# Altium schematic sheet Logica_ADC.SchDoc: CSN Detector V5
size A4; CheckedBy: RCP; Author: RCP; DrawnBy: RCP; Address1: LIM-HGGM; Address3: RCP; DocumentNumber: 1; Revision: 1; SheetNumber: 2; SheetTotal: 2; PageSetup: Record=PageOptions|CenterHorizontal=True|CenterVertical=True|PrintScale=0.97|XCorrection=1.00|YCorrection=1.00|PrintKind=0|BorderSize=5000000|LeftOffset=0|BottomOffset=0|Orientation=2|PaperLength=1000|PaperWidth=1000|Scale=100|PaperSource=7|PrintQuality=-4|MediaType=1|DitherType=10|PaperKind=A4|PrintScaleMode=1
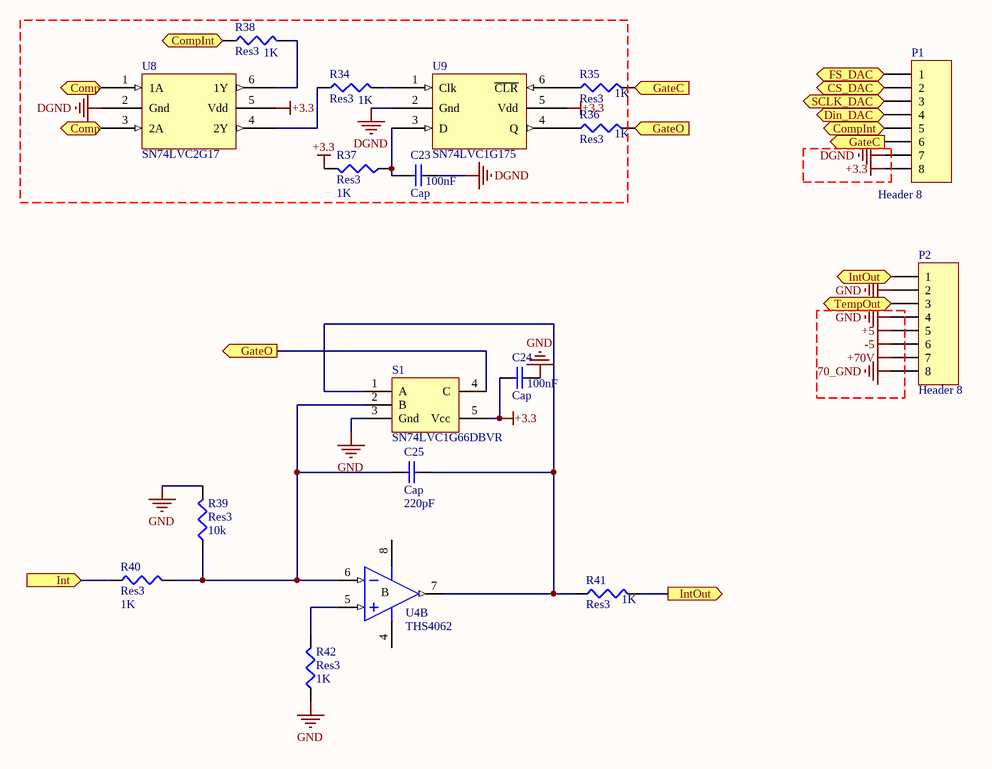
[diagram p0: Logica_ADC.SchDoc]

## Parts
C23  Cap  value 100nF  [J1-0603]
C24  Cap  value 100nF  [J1-0603]
C25  Cap  value 220pF  [J1-0603]
P1  Header 8  [HDR1X8]
P2  Header 8  [HDR1X8]
R34  Res3  value 1K  [J1-0603]
R35  Res3  value 1K  [J1-0603]
R36  Res3  value 1K  [J1-0603]
R37  Res3  value 1K  [J1-0603]
R38  Res3  value 1K  [J1-0603]
R39  Res3  value 10k  [J1-0603]
R40  Res3  value 1K  [J1-0603]
R41  Res3  value 1K  [J1-0603]
R42  Res3  value 1K  [J1-0603]
S1  SN74LVC1G66DBVR  [SOT23-5]
U4  THS4062  [SO-8_N]  (part B of 2)
U8  SN74LVC2G17  [SOT23-6_N]
U9  SN74LVC1G175  [SOT23-6_N]

## Ports
Comp (out), CompInt (out), CS_DAC (out), Din_DAC (out), FS_DAC (out), GateC (out), GateO (out), Int (in), IntOut (out), SCLK_DAC (out), TempOut (out)

## Nets
70_GND: P2.8
+3.3: C24.2 P1.8 R37.2 S1.5(Vcc) U8.5(Vdd) U9.5(Vdd)
+5: P2.5
+70V: P2.7
-5: P2.6
DGND: C23.1 P1.7 U8.2(Gnd) U9.2(Gnd)
GND: C24.1 P2.2 P2.4 R39.2 R42.1 S1.3(Gnd)
Comp: U8.1(1A) U8.3(2A) ; port Comp
CompInt: P1.5 R38.1 ; port CompInt
CS_DAC: P1.2 ; port CS_DAC
Din_DAC: P1.4 ; port Din_DAC
FS_DAC: P1.1 ; port FS_DAC
GateC: P1.6 R35.2 ; port GateC
GateO: R36.2 S1.4(C) ; port GateO
Int: R40.1 ; port Int
IntOut: P2.1 R41.2 ; port IntOut
SCLK_DAC: P1.3 ; port SCLK_DAC
TempOut: P2.3 ; port TempOut
NetC23_2: C23.2 R37.1 U9.3(D)
NetC25_1: C25.1 R39.1 R40.2 S1.2(B) U4.6(IN-)
NetC25_2: C25.2 R41.1 S1.1(A) U4.7(OUT)
NetR34_1: R34.1 U8.4(2Y)
NetR34_2: R34.2 U9.1(Clk)
NetR35_1: R35.1 U9.6(~{CLR})
NetR36_1: R36.1 U9.4(Q)
NetR38_2: R38.2 U8.6(1Y)
NetR42_2: R42.2 U4.5(IN+)

Not connected (* = marked no-connect by the designer): U4 4(V-) 8(V+)

## Notes on the sheet
- Title
- Size:
- Date:
- A4
- Number:
- Time:
- Revision:
- Sheet
- of
- File:
- (in symbol AD8002AR, part B) B

## Library data of the parts
C23-C25 = Cap: Capacitor; Published: 8-Jun-2000; LatestRevisionDate: 17-Jul-2002; LatestRevisionNote: Re-released for DXP Platform.; PackageReference: RAD-0.3; Publisher: Altium Limited; PackageDescription: Radial Cap, Thru-Hole; 2 Leads; 0.3 in Pin Spacing
P1 P2 = Header 8: Header, 8-Pin; LatestRevisionDate: 17-Jul-2002; LatestRevisionNote: Re-released for DXP Platform.; Publisher: Altium Limited
R34-R42 = Res3: Resistor; Published: 8-Jun-2000; LatestRevisionDate: 29-May-2009; LatestRevisionNote: IPC-7351 Footprint Added.; PackageReference: J1-0603; Publisher: Altium Limited; PackageDescription: Chip Resistor
U4 = AD8002AR: Dual 600MHz, 50mW Current Feedback Amplifier; Published: 8-Jun-2000; LatestRevisionDate: 13-Apr-2006; LatestRevisionNote: IPC-7351 Footprint Added.; DatasheetVersion: REV. C 1999; PackageVersion: revA; PackageReference: SO-8; Publisher: Altium Limited; PackageDescription: 8-Pin Small Outline Integrated Circuit 1.27 mm Pitch; Code_JEDEC: MS-012-AA; Code_IPC: SOIC127P600-8; ComponentLink1Description: Manufacturer Link; ComponentLink1URL: http://www.analog.com/en/prod/0,,759_786_AD8002%2C00.html; ComponentLink2Description: Datasheet; ComponentLink2URL: http://www.analog.com/UploadedFiles/Data_Sheets/147523773AD8002_d.pdf
U8 = SN74LVC2G17: Schmitt Buffer 2 gates
U9 = SN74LVC1G175: D-type flip-flop with clear